# Altium schematic sheet con-som.SchDoc
size C; CompanyName: Signal Laboratories, Inc.; Address1: 3479 Edison Way; Address2: Menlo Park CA 94025; Address3: +1 (877) 778-8435; Address4: siglabs.com; Revision: 1; SheetNumber: 1; SheetTotal: 1
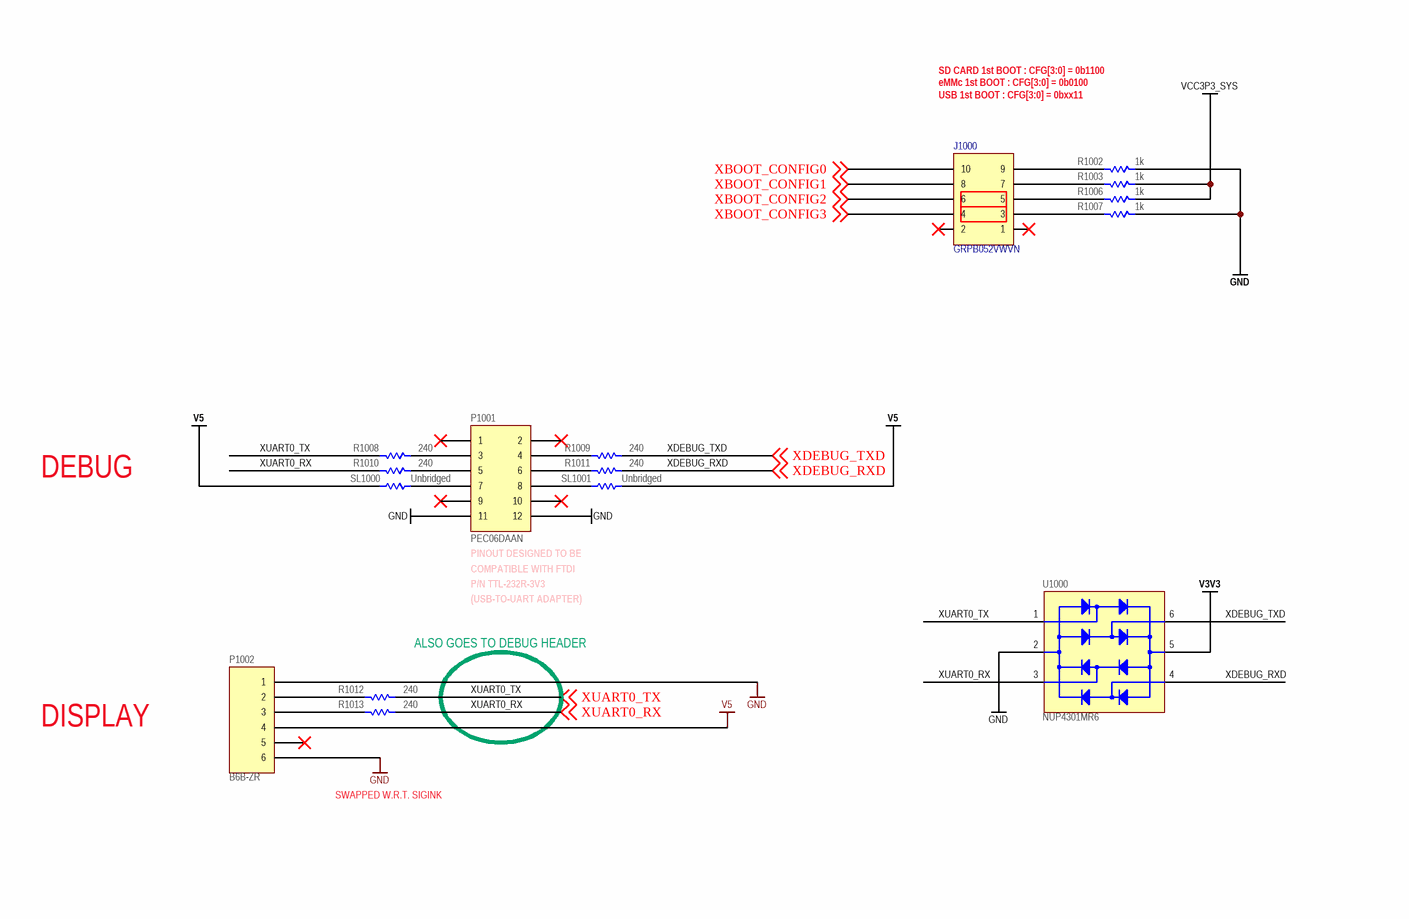
[diagram p0: con-som.SchDoc, top left]
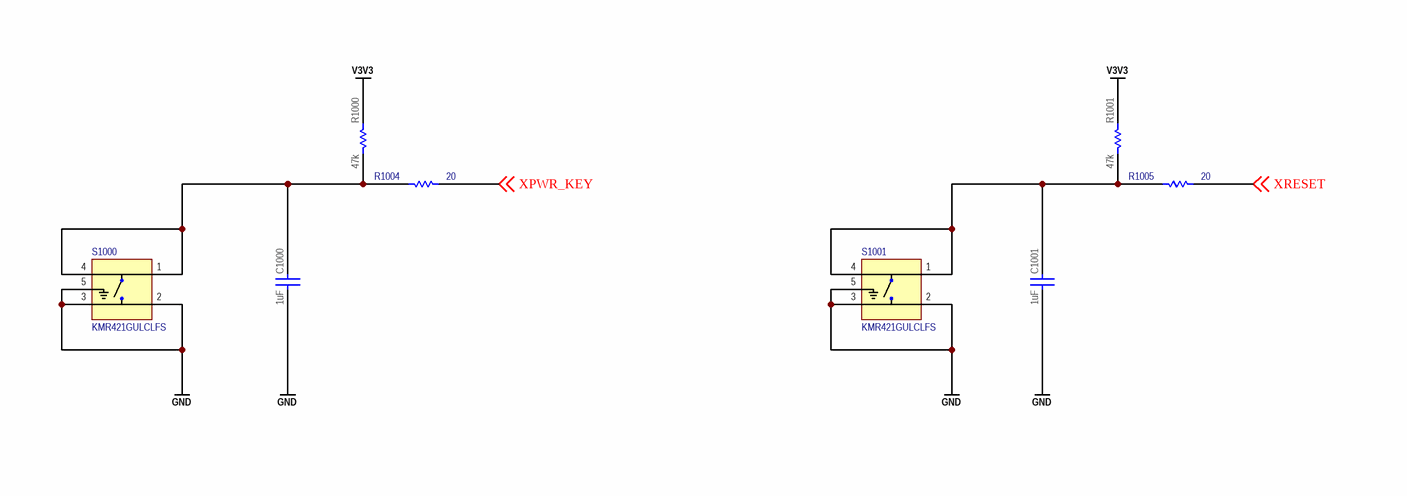
[diagram p1: con-som.SchDoc, top right]
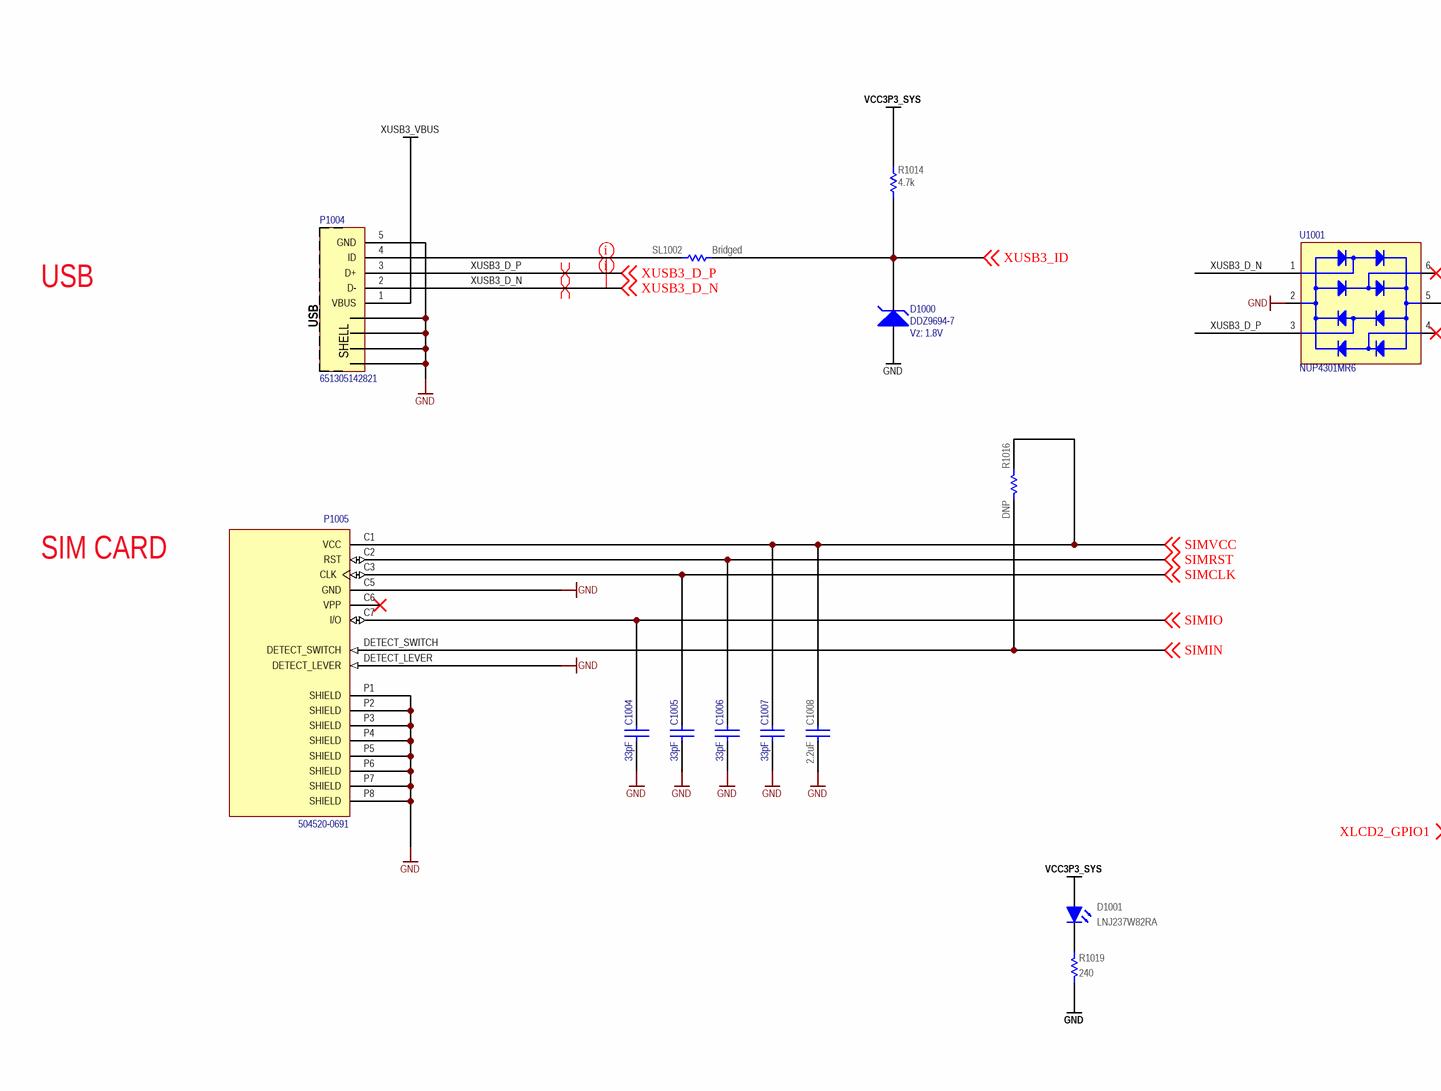
[diagram p2: con-som.SchDoc, bottom left]
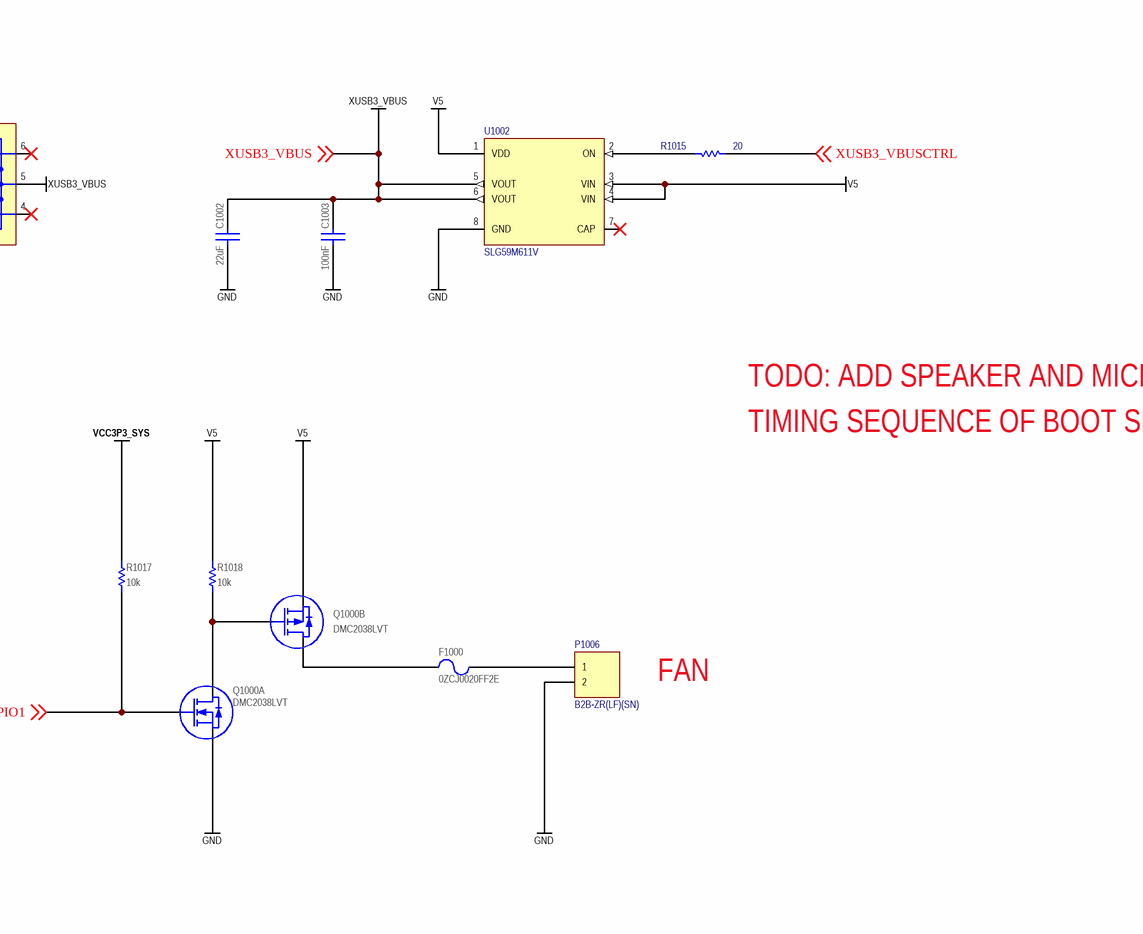
[diagram p3: con-som.SchDoc, bottom right]

## Parts
C1000  value 1uF  [CAPC160X80X90L20N]  (hidden comment: C1608X7R1A105M080)
C1001  value 1uF  [CAPC160X80X90L20N]  (hidden comment: C1608X7R1A105M080)
C1002  value 22uF  [CAPC200X125X145L45N]  (hidden comment: C2012X7S1A226M125)
C1003  value 100nF  [CAPC100X50X55L25N]  (hidden comment: GCM155R71H104KE02)
C1004  value 33pF  [0402]  (hidden comment: CBR04C330F5GAC)
C1005  value 33pF  [0402]  (hidden comment: CBR04C330F5GAC)
C1006  value 33pF  [0402]  (hidden comment: CBR04C330F5GAC)
C1007  value 33pF  [0402]  (hidden comment: CBR04C330F5GAC)
C1008  value 2.2uF  [CAPC160X80X90L20N]  (hidden comment: C1608X7R1A225M080)
D1000  DDZ9694-7  Vz: 1.8V  [SOD123]
D1001  LNJ237W82RA  [0603_LED]
F1000  0ZCJ0020FF2E  [1206]
J1000  GRPB052VWVN  [GRPB052VWVN]
P1001  PEC06DAAN  [HDR2X6]
P1002  B6B-ZR  [B6B-ZR]
P1004  651305142821  [651305142821]
P1005  504520-0691  [504520-0691]
P1006  B2B-ZR(LF)(SN)  [B2B-ZR]
Q1000  DMC2038LVT  [TSOP-6]  (parts A,B of 2)
R1000  value 47k  [RESC1005X40N]  (hidden comment: ERJ-2RKF4702X)
R1001  value 47k  [RESC1005X40N]  (hidden comment: ERJ-2RKF4702X)
R1002  value 1k  [RESC1005X40N]  (hidden comment: ERJ-2RKF1001X)
R1003  value 1k  [RESC1005X40N]  (hidden comment: ERJ-2RKF1001X)
R1004  value 20  [0402]  (hidden comment: ERJ-2RKF20R0X)
R1005  value 20  [0402]  (hidden comment: ERJ-2RKF20R0X)
R1006  value 1k  [RESC1005X40N]  (hidden comment: ERJ-2RKF1001X)
R1007  value 1k  [RESC1005X40N]  (hidden comment: ERJ-2RKF1001X)
R1008  value 240  [RESC1005X40N]  (hidden comment: ERJ-2RKF2400X)
R1009  value 240  [RESC1005X40N]  (hidden comment: ERJ-2RKF2400X)
R1010  value 240  [RESC1005X40N]  (hidden comment: ERJ-2RKF2400X)
R1011  value 240  [RESC1005X40N]  (hidden comment: ERJ-2RKF2400X)
R1012  value 240  [RESC1005X40N]  (hidden comment: ERJ-2RKF2400X)
R1013  value 240  [RESC1005X40N]  (hidden comment: ERJ-2RKF2400X)
R1014  value 4.7k  [RESC1005X40N]  (hidden comment: ERJ-2RKF4701X)
R1015  value 20  [0402]  (hidden comment: ERJ-2RKF20R0X)
R1016  Do Not Place: DNP  [RESC1005X40N]  (hidden comment: ERJ-2RKF4702X)
R1017  value 10k  [RESC1005X40N]  (hidden comment: ERJ-2RKF1002X)
R1018  value 10k  [RESC1005X40N]  (hidden comment: ERJ-2RKF1002X)
R1019  value 240  [RESC1005X40N]  (hidden comment: ERJ-2RKF2400X)
S1000  KMR421GULCLFS  [SW_KMR421GULCLFS]
S1001  KMR421GULCLFS  [SW_KMR421GULCLFS]
SL1000  value Unbridged  [SOLDERLINK0603X26N]  (hidden comment: SOLDER_LINK)  (no BOM)
SL1001  value Unbridged  [SOLDERLINK0603X26N]  (hidden comment: SOLDER_LINK)  (no BOM)
SL1002  value Bridged  [SOLDERLINK0603X26N_BRIDGED]  (hidden comment: SOLDER_LINK_BRIDGED)  (no BOM)
U1000  NUP4301MR6  [SOT23-6]
U1001  NUP4301MR6  [SOT23-6]
U1002  SLG59M611V  [DFN200X150X80-8N]

## Nets
GND: C1000.1 C1001.1 C1002.1 C1003.1 C1004.2 C1005.2 C1006.2 C1007.2 C1008.1 D1000.1(A) P1001.11 P1001.12 P1002.1 P1002.6 P1004.5(GND) P1004.SHELL(SHIELD) P1004.SHELL1(SHIELD) P1004.SHELL2(SHIELD) P1004.SHELL3(SHIELD) P1005.C5(GND) P1005.DETECT_LEVER P1005.P1(SHIELD) P1005.P2(SHIELD) P1005.P3(SHIELD) P1005.P4(SHIELD) P1005.P5(SHIELD) P1005.P6(SHIELD) P1005.P7(SHIELD) P1005.P8(SHIELD) P1006.2 Q1000.5(S) R1002.2 R1007.2 R1019.2 S1000.2 S1000.3 S1000.5(G) S1001.2 S1001.3 S1001.5(G) U1000.2(VN) U1001.2(VN) U1002.8(GND)
V3V3: R1000.2 R1001.2 U1000.5(VP)
V5: P1002.4 Q1000.2(S) R1018.2 SL1000.1 SL1001.2 U1002.1(VDD) U1002.3(VIN) U1002.4(VIN)
VCC3P3_SYS: D1001.1(A) R1003.2 R1006.2 R1014.2 R1017.2
XUSB3_VBUS: C1002.2 C1003.2 P1004.1(VBUS) U1001.5(VP) U1002.5(VOUT) U1002.6(VOUT) ; off-sheet XUSB3_VBUS
SIMCLK: C1005.1 P1005.C3(CLK) ; off-sheet SIMCLK
SIMIN: P1005.DETECT_SWITCH R1016.1 ; off-sheet SIMIN
SIMIO: C1004.1 P1005.C7(I/O) ; off-sheet SIMIO
SIMRST: C1006.1 P1005.C2(RST) ; off-sheet SIMRST
SIMVCC: C1007.1 C1008.2 P1005.C1(VCC) R1016.2 ; off-sheet SIMVCC
XBOOT_CONFIG0: J1000.10 ; off-sheet XBOOT_CONFIG0
XBOOT_CONFIG1: J1000.8 ; off-sheet XBOOT_CONFIG1
XBOOT_CONFIG2: J1000.6 ; off-sheet XBOOT_CONFIG2
XBOOT_CONFIG3: J1000.4 ; off-sheet XBOOT_CONFIG3
XDEBUG_RXD: R1011.2 U1000.4(C) ; off-sheet XDEBUG_RXD
XDEBUG_TXD: R1009.2 U1000.6(D) ; off-sheet XDEBUG_TXD
XLCD2_GPIO1: Q1000.1(G) R1017.1 ; off-sheet XLCD2_GPIO1
XPWR_KEY: R1004.2 ; off-sheet XPWR_KEY
XRESET: R1005.2 ; off-sheet XRESET
XUART0_RX: R1010.1 R1013.2 U1000.3(B) ; off-sheet XUART0_RX
XUART0_TX: R1008.1 R1012.2 U1000.1(A) ; off-sheet XUART0_TX
XUSB3_D_N: P1004.2(D-) U1001.1(A) ; off-sheet XUSB3_D_N
XUSB3_D_P: P1004.3(D+) U1001.3(B) ; off-sheet XUSB3_D_P
XUSB3_ID: D1000.2(C) R1014.1 SL1002.2 ; off-sheet XUSB3_ID
XUSB3_VBUSCTRL: R1015.2 ; off-sheet XUSB3_VBUSCTRL
NetC1000_2: C1000.2 R1000.1 R1004.1 S1000.1 S1000.4
NetC1001_2: C1001.2 R1001.1 R1005.1 S1001.1 S1001.4
NetD1001_2: D1001.2(K) R1019.1
NetF1000_1: F1000.1 Q1000.4(D)
NetF1000_2: F1000.2 P1006.1
NetJ1000_3: J1000.3 R1007.1
NetJ1000_5: J1000.5 R1006.1
NetJ1000_7: J1000.7 R1003.1
NetJ1000_9: J1000.9 R1002.1
NetP1001_3: P1001.3 R1008.2
NetP1001_4: P1001.4 R1009.1
NetP1001_5: P1001.5 R1010.2
NetP1001_6: P1001.6 R1011.1
NetP1001_7: P1001.7 SL1000.2
NetP1001_8: P1001.8 SL1001.1
NetP1002_2: P1002.2 R1012.1
NetP1002_3: P1002.3 R1013.1
NetP1004_4: P1004.4(ID) SL1002.1
NetQ1000_3: Q1000.3(G) Q1000.6(D) R1018.1
NetR1015_1: R1015.1 U1002.2(ON)

Not connected (* = marked no-connect by the designer): J1000 1* 2*; P1001 1* 2* 9* 10*; P1002 5*; P1005 C6(VPP)*; U1001 4(C)* 6(D)*; U1002 7(CAP)*

## Layout directives
net class USB: XUSB3_D_N, XUSB3_D_P
differential pair: XUSB3_D_N, XUSB3_D_P

## Notes on the sheet
- SD CARD 1st BOOT : CFG[3:0] = 0b1100
  eMMc 1st BOOT : CFG[3:0] = 0b0100
  USB 1st BOOT : CFG[3:0] = 0bxx11
- DEBUG
- (near P1001) PINOUT DESIGNED TO BE
- (near P1001) COMPATIBLE WITH FTDI
- P/N TTL-232R-3V3
- (USB-TO-UART ADAPTER)
- ALSO GOES TO DEBUG HEADER
- DISPLAY
- SWAPPED W.R.T. SIGINK
- USB
- TODO: ADD SPEAKER AND MICROPHONE
- SIM CARD
- TIMING SEQUENCE OF BOOT SEL POWER PINS
- FAN
- Title
- Engineer
- Revision
- Drawn By
- Sheet
- of
- Checked By
- Date
- (in symbol 651305142821) USB

## Library data of the parts
C1000 C1001 = CAP: Ceramic Capacitor 1uF ±20% 10V X7R 0603; Manufacturer: TDK; Tr: -55:125; Do Not Place: DNP; Manufacturer P/N: C1608X7R1A105M080; Tolerance: ±20%; Voltage: 10V; Footprint: *; Package: 0603
C1002 = CAP: Ceramic Capacitor 22uF ±20% 10V X7S 0805; Manufacturer: TDK; Tr: -55:125; Manufacturer P/N: C2012X7S1A226M125; Tolerance: ±20%; Voltage: 10V; Package: 0805
C1003 = CAP: Ceramic Capacitor 100nF ±10% 50V X7R 0402; Manufacturer: Murata; Tr: -55:125; Manufacturer P/N: GCM155R71H104KE02; Tolerance: ±10%; Voltage: 50V; Footprint: *; Package: 0402
C1004-C1007 = CAP 0603: Ceramic Capacitor 33pF ±1% 50V NP0 0402; Manufacturer: Kemet; Tr: -55:125; Voltage: 50V; Manufacturer P/N: CBR04C330F5GAC; Package: 0402; Do Not Place: *; Tolerance: ±1%
C1008 = CAP: Ceramic Capacitor 2.2uF ±20% 10V X7R 0603; Manufacturer: TDK; Tr: -55:125; Manufacturer P/N: C1608X7R1A225M080; Tolerance: ±20%; Voltage: 10V; Footprint: *; Package: 0603
D1000 = DDZ9694-7: Zener Diode 1.8V 500mW SOD123; Manufacturer P/N: DDZ9678-7; Manufacturer: Diodes, Inc.
D1001 = LED0603RD: LED, SMT 0603, Color Red, 5mA, 1.85V; Manufacturer: Panasonic; Do Not Place: DNP; Manufacturer P/N: LNJ237W82RA; Package: 0603 Polarized
F1000 = 0ZCJ0020FF2E: PTC Resettable Fuse, 0.2A, 30V, SMD 1206; Manufacturer: Bell Fuse; Manufacturer P/N: 0ZCJ0020FF2E
J1000 = GRPB052VWVN: Male Header, 0.050" Pitch, 2x5 Position; Manufacturer: Sullins; Manufacturer P/N: GRPB052VWVN
P1001 = Header 6X2H: Header, 6-Pin, Dual row; Manufacturer: Sullins; Manufacturer P/N: PEC06DAAN
P1002 = TBD: Header, 6-Pin, Single row, Vertical; Manufacturer: JST; Manufacturer P/N: B6B-ZR
P1004 = 651305142821: Right Angle SMT USB Type-AB Connector Receptacle; Manufacturer: Wurth Elektronik; Manufacturer P/N: 651305142821
P1005 = 504520-0691: micro-SIM Card Connector; Manufacturer: Molex; Availability: Good; Package: None; Manufacturer P/N: 504520-0691; Price: 1.31 USD; Value: *
P1006 = Header 2: Header, 2-Pin; Manufacturer: JST; Manufacturer P/N: B2B-ZR(LF)(SN)
Q1000 = DMC2038LVT: Complementary MOSFET Pair; Manufacturer: Diodes, Inc.; Manufacturer P/N: DMC2038LVT
R1000 R1001 R1016 = RES: Thick Film Resistor 47k ±1% 0.1W 75V 0402; Manufacturer: Panasonic; Tcr: ±100; Tr: -55:155; Voltage: 75; Power: 0.1; Tolerance: ±1%; Manufacturer P/N: ERJ-2RKF4702X; Alternatives: *; Footprint: *; Package: 0402
  R1016: Value: 47k
R1002 R1003 R1006 R1007 = RES: Thick Film Resistor 1k ±1% 0.1W 0402; Manufacturer: Panasonic; Tcr: ±100; Tr: -55:155; Voltage: 75; Power: 0.1; Tolerance: ±1%; Manufacturer P/N: ERJ-2RKF1001X; Alternatives: *; Footprint: *; Package: 0402
R1004 R1005 R1015 = RES 0402: Thick Film Resistor 20 ±1% 0402; Manufacturer: Panasonic; Manufacturer P/N: RC0402FR-0720L; Tr: -55:155; Package: 0402; Tolerance: ±1%
R1008-R1013 = RES: Thick Film Resistor 240 ±1% 0.1W 75V 0402; Manufacturer: Panasonic; Tcr: ±100; Tr: -55:155; Voltage: 75; Power: 0.1; Tolerance: ±1%; Manufacturer P/N: ERJ-2RKF2400X; Alternatives: *; Footprint: *; Package: 0402
R1014 = RES: Thick Film Resistor 4.7k ±1% 0.1W 75V 0402; Manufacturer: Panasonic; Tcr: ±100; Tr: -55:155; Voltage: 75; Power: 0.1; Tolerance: ±1%; Manufacturer P/N: ERJ-2RKF4701X; Alternatives: *; Footprint: *; Package: 0402
R1017 R1018 = RES: Thick Film Resistor 10k ±1% 0.1W 0402; Manufacturer: Panasonic; Tcr: ±100; Tr: -55:155; Voltage: 50; Power: 0.1; Manufacturer P/N: ERJ-2RKF1002X; Tolerance: ±1%; Alternatives: *; Footprint: *; Package: 0402
R1019 = RES: Thick Film Resistor 240 ±1% 0.1W 75V 0402; Manufacturer: Panasonic; Tcr: ±100; Tr: -55:155; Voltage: 75; Power: 0.1; Do Not Place: DNP; Tolerance: ±1%; Manufacturer P/N: ERJ-2RKF2400X; Alternatives: *; Footprint: *; Package: 0402
S1000 S1001 = KMR421GULCLFS: Switch Tactile N.O. SPST Round Button Gull Wing 0.05A 32VDC 1VA 200000Cycles 2N SMD Automotive T/R; Manufacturer: C&K Components; Do Not Place: DNP; Availability: Good; Package: None; Manufacturer P/N: KMR421GULCLFS; Price: 0.29 USD; Value: *
SL1000 SL1001 = RES: Solder Link Unbridged; Manufacturer P/N: *; Manufacturer: *
SL1002 = RES: Solder Link Bridged; Manufacturer P/N: *; Manufacturer: *
U1000 U1001 = NUP4301MR6: 4-Lane TVS Diode Array; Manufacturer: On Semiconductor; Manufacturer P/N: NUP4301MR6
U1002 = SLG59M611V: High-Side Load Switch; Manufacturer: Silego; Package: WFDFN-8 Silego; Manufacturer P/N: SLG59M611V